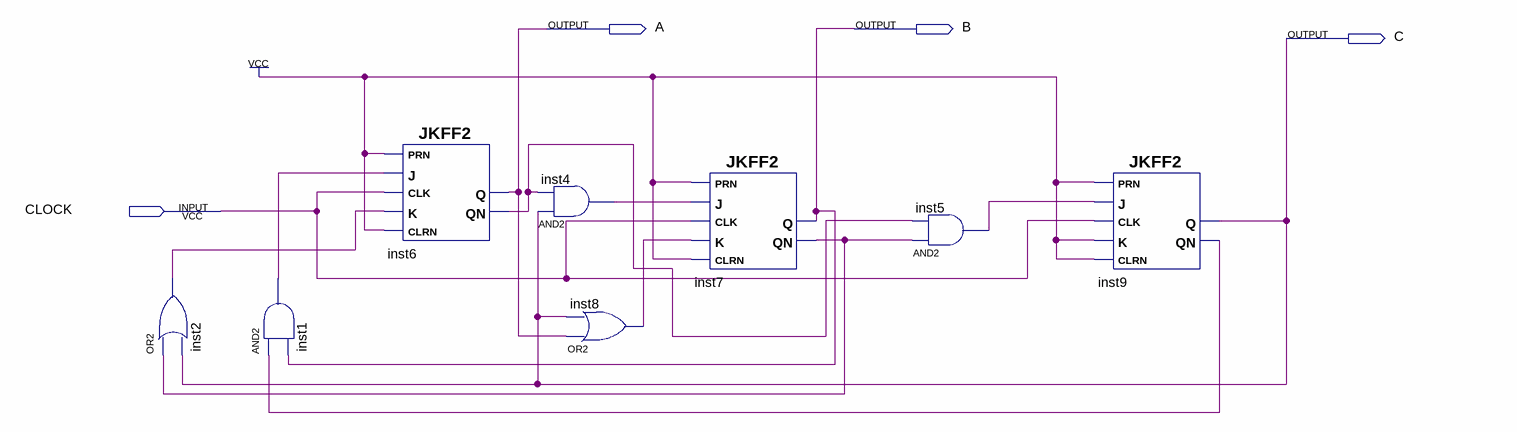
[diagram p0: schematic sheet]
// Quartus schematic ex3-lista4.bdf as structural Verilog: 8 symbols, 4 pins
module \ex3-lista4  (
  input  CLOCK,
  output A,
  output B,
  output C
);

  wire inst1_out, inst2_out, inst4_out, inst5_out, inst6_qn, inst7_qn, inst8_out, inst9_qn;

  or inst2 (inst2_out, inst7_qn, C);
  and inst1 (inst1_out, inst9_qn, B);
  JKFF2 inst6 (.K(inst2_out), .CLRN(1'b1), .CLK(CLOCK), .PRN(1'b1), .J(inst1_out), .QN(inst6_qn), .Q(A));
  and inst4 (inst4_out, C, inst6_qn);
  or inst8 (inst8_out, A, C);
  JKFF2 inst7 (.K(inst8_out), .CLRN(1'b1), .CLK(CLOCK), .PRN(1'b1), .J(inst4_out), .QN(inst7_qn), .Q(B));
  and inst5 (inst5_out, inst7_qn, inst6_qn);
  JKFF2 inst9 (.K(1'b1), .CLRN(1'b1), .CLK(CLOCK), .PRN(1'b1), .J(inst5_out), .QN(inst9_qn), .Q(C));
endmodule
